# Altium project Elektor_WifiRadio.PrjPcb
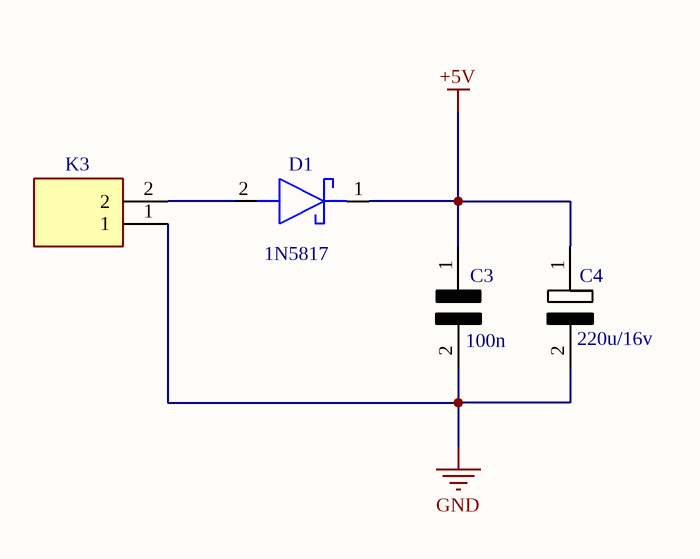
[diagram p0: PowerUnit.SchDoc]
4 sheets, 32 parts. Net scope: flat (ports and power ports of the same name join across sheets).
Sheets:
  PowerUnit.SchDoc
  IR-interface.SchDoc
  ComputeUnit.SchDoc
  DisplayUnit.SchDoc

## Sheet PowerUnit.SchDoc
size A4; SheetNumber: 1; SheetTotal: 4

### Parts
C3  100n  [C0805]
C4  220u/16v  [C0805]
D1  1N5817  [1n5817_footprint]
K3  Con2Polig  [OSTTE020104]  (value not drawn)

### Nets
+5V: C3.1 C4.1 D1.1(K)
GND: C3.2 C4.2 K3.1
NetD1_2: D1.2(A) K3.2

### Library data of the parts
C3 = KeramischeC0805_1: 0805 ceramic capacitor; Manufacturer_Name: Murata Electronics; Manufacturer_Part_Number: GRM188R71H103KA01D; Datasheet Link: https://datasheet.datasheetarchive.com/originals/distributors/Datasheets_SAMA/ec4f1577dddcc7a13ddad897a28002d3.pdf; Height: 0.9mm; Mouser Part Number: 81-GRM39X103K50D; Mouser Price/Stock: https://www.mouser.co.uk/ProductDetail/Murata-Electronics/GRM188R71H103KA01D?qs=WWniysbtxULrL2ljbViAbw%3D%3D; Arrow Part Number: GRM188R71H103KA01D; Arrow Price/Stock: https://www.arrow.com/en/products/grm188r71h103ka01d/murata-manufacturing?region=europe
C4 = elektrolytischeC0805: 0805 ceramic capacitor; Manufacturer_Name: Murata Electronics; Manufacturer_Part_Number: GRM188R71H103KA01D; Datasheet Link: https://datasheet.datasheetarchive.com/originals/distributors/Datasheets_SAMA/ec4f1577dddcc7a13ddad897a28002d3.pdf; Height: 0.9mm; Mouser Part Number: 81-GRM39X103K50D; Mouser Price/Stock: https://www.mouser.co.uk/ProductDetail/Murata-Electronics/GRM188R71H103KA01D?qs=WWniysbtxULrL2ljbViAbw%3D%3D; Arrow Part Number: GRM188R71H103KA01D; Arrow Price/Stock: https://www.arrow.com/en/products/grm188r71h103ka01d/murata-manufacturing?region=europe
D1 = 1N5817: Schottky Diode; Manufacturer_Name: Rectron; Datasheet Link: https://www.arrow.com/en/products/1n5817/rectron; Manufacturer_Part_Number: 1N5817; Arrow Part Number: 1N5817; Arrow Price/Stock: https://www.arrow.com/en/products/1n5817/rectron?region=nac
K3 = Con2Polig: Connector; Manufacturer_Name: On Shore Technology Inc.; Datasheet Link: https://datasheet.datasheetarchive.com/originals/dk/DKDS-18/336634.pdf; Height: 8.7mm; Manufacturer_Part_Number: OSTTE020104

## Sheet IR-interface.SchDoc
size A4; SheetNumber: 2; SheetTotal: 3
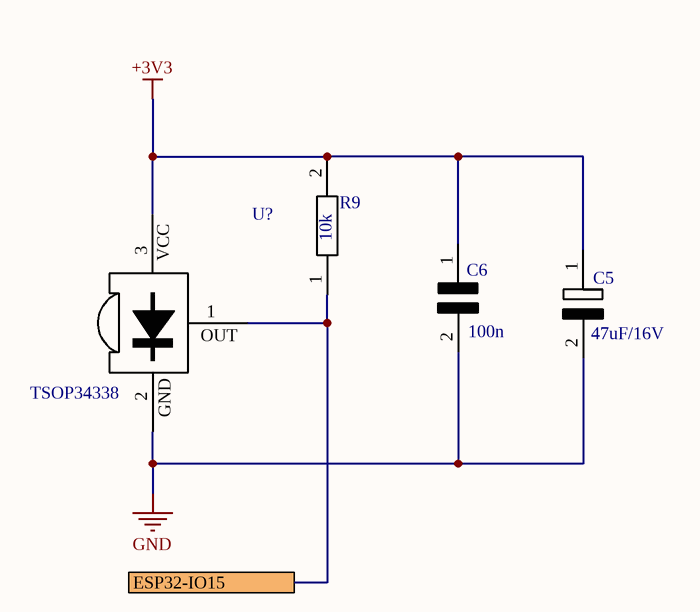
[diagram p1: IR-interface.SchDoc]

### Parts
C5  47uF/16V  [C0805]
C6  100n  [C0805]
R9  10k  [RESC2012X60N]
U?  TSOP34338  [TO_TSOP31236]

### Ports
ESP32-IO15

### Nets
+3V3: C5.1 C6.1 R9.2 U?.3(VS)
GND: C5.2 C6.2 U?.2(GND)
NetJ?_J3_14: R9.1 U?.1(OUT) ; port ESP32-IO15

### Notes on the sheet
- (in symbol TSOP34338) VCC

### Library data of the parts
C5 = elektrolytischeC0805: as C4 on sheet PowerUnit; Datasheet Link: https://datasheet.datasheetarchive.com/originals/distributors/Datasheets_SAMA/ec4f1577dddcc7a13ddad897a28002d3.pdf; Height: 0.9mm; Mouser Part Number: 81-GRM39X103K50D; Mouser Price/Stock: https://www.mouser.co.uk/ProductDetail/Murata-Electronics/GRM188R71H103KA01D?qs=WWniysbtxULrL2ljbViAbw%3D%3D; Arrow Part Number: GRM188R71H103KA01D; Arrow Price/Stock: https://www.arrow.com/en/products/grm188r71h103ka01d/murata-manufacturing?region=europe
C6 = KeramischeC0805_1: as C3 on sheet PowerUnit; Datasheet Link: https://datasheet.datasheetarchive.com/originals/distributors/Datasheets_SAMA/ec4f1577dddcc7a13ddad897a28002d3.pdf; Height: 0.9mm; Mouser Part Number: 81-GRM39X103K50D; Mouser Price/Stock: https://www.mouser.co.uk/ProductDetail/Murata-Electronics/GRM188R71H103KA01D?qs=WWniysbtxULrL2ljbViAbw%3D%3D; Arrow Part Number: GRM188R71H103KA01D; Arrow Price/Stock: https://www.arrow.com/en/products/grm188r71h103ka01d/murata-manufacturing?region=europe
R9 = Resistor0805: Manufacturer_Name: Vishay; Manufacturer_Part_Number: CRCW08050000Z0EAHP; Datasheet Link: https://componentsearchengine.com/Datasheets/1/CRCW08051R00FKEAHP.pdf; Height: 0.6mm; Mouser Part Number: 71-CRCW08050000Z0EAH; Mouser Price/Stock: https://www.mouser.co.uk/ProductDetail/Vishay-Dale/CRCW08050000Z0EAHP?qs=pTGEtN%252BMLlDLrJUqQmN2jA%3D%3D; Arrow Part Number: CRCW08050000Z0EAHP; Arrow Price/Stock: https://www.arrow.com/en/products/crcw08050000z0eahp/vishay?region=nac
U? = TSOP34338: No Description Available; Mfr_Name: Vishay; Type: Type; RefDes: RefDes

## Sheet ComputeUnit.SchDoc
size A4; SheetNumber: 3; SheetTotal: 4
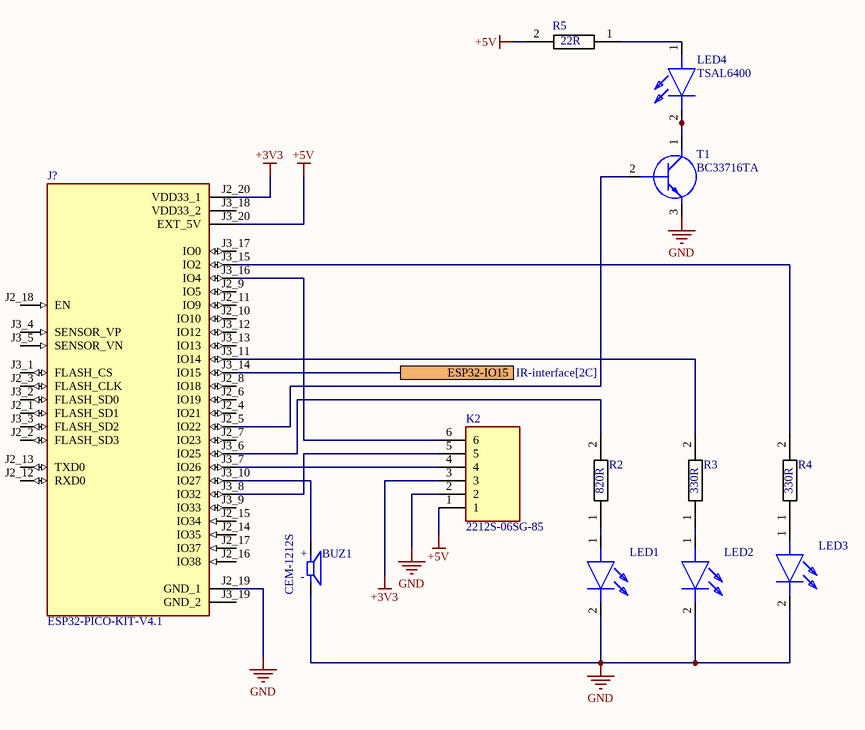
[diagram p2: ComputeUnit.SchDoc]

### Parts
BUZ1  CEM-1212S  [CUI_CEM-1212S]
J?  ESP32-PICO-KIT-V4.1  [XCVR_ESP32-PICO-KIT-V4.1]
K2  2212S-06SG-85  [RHDR6W74P0X254_1X6_1574X250X850P]
LED1  TLHO4200  [TLHO4200]  (value not drawn)
LED2  TLHO4200  [TLHO4200]  (value not drawn)
LED3  TLHO4200  [TLHO4200]  (value not drawn)
LED4  TSAL6400  [TSAL6400]
R2  820R  [RESC2012X60N]
R3  330R  [RESC2012X60N]
R4  330R  [RESC2012X60N]
R5  22R  [RESC2012X60N]
T1  BC33716TA  [BC33716TA]

### Ports
ESP32-IO15 (see IR-interface[2C])

### Nets
+3V3: J?.J2_20(VDD33_1) K2.3
+5V: J?.J3_20(EXT_5V) K2.1 R5.2
GND: BUZ1.M J?.J2_19(GND_1) K2.2 LED1.2(K) LED2.2(K) LED3.2(K) T1.3(E)
NetBUZ1_P: BUZ1.P J?.J3_10(IO27)
NetJ?_J2_5: J?.J2_5(IO22) T1.2(B)
NetJ?_J3_6: J?.J3_6(IO25) R2.2
NetJ?_J3_7: J?.J3_7(IO26) K2.4
NetJ?_J3_8: J?.J3_8(IO32) K2.5
NetJ?_J3_11: J?.J3_11(IO14) R3.2
NetJ?_J3_14: J?.J3_14(IO15) ; port ESP32-IO15
NetJ?_J3_15: J?.J3_15(IO2) R4.2
NetJ?_J3_16: J?.J3_16(IO4) K2.6
NetLED1_1: LED1.1(A) R2.1
NetLED2_1: LED2.1(A) R3.1
NetLED3_1: LED3.1(A) R4.1
NetLED4_1: LED4.1(A) R5.1
NetLED4_2: LED4.2(K) T1.1(C)

Not connected (* = marked no-connect by the designer): J? J2_1(FLASH_SD1) J2_2(FLASH_SD3) J2_3(FLASH_CLK) J2_4(IO21) J2_6(IO19) J2_7(IO23) J2_8(IO18) J2_9(IO5) J2_10(IO10) J2_11(IO9) J2_12(RXD0) J2_13(TXD0) J2_14(IO35) J2_15(IO34) J2_16(IO38) J2_17(IO37) J2_18(EN) J3_1(FLASH_CS) J3_2(FLASH_SD0) J3_3(FLASH_SD2) J3_4(SENSOR_VP) J3_5(SENSOR_VN) J3_9(IO33) J3_12(IO12) J3_13(IO13) J3_17(IO0) J3_18(VDD33_2) J3_19(GND_2)

### Notes on the sheet
- (in symbol CEM-1212S) +; -

### Library data of the parts
BUZ1 = CEM-1212S: 12 mm, 12 V, 85 dB, Through Hole, Sealed, Magnetic Audio Transducer Buzzer; MF: CUI Devices; Arrow_Electronics-Purchase-URL: https://snapeda.com/shop?store=Arrow+Electronics&id=601563; Value: *; SnapEDA_Link: https://www.snapeda.com/parts/CEM-1212S/CUI%20Devices/view-part/601563/?ref=snap; CUI_purchase_URL: https://www.cuidevices.com/product/audio/buzzers/audio-transducers/cem-1212s?utm_source=snapeda.com&utm_medium=referral&utm_campaign=snapedaBOM; MP: CEM-1212S; Availability: Good; Mouser-Purchase-URL: https://snapeda.com/shop?store=Mouser&id=601563; Price: None; DigiKey-Purchase-URL: https://snapeda.com/shop?store=DigiKey&id=601563; Package: TO-220 CUI Inc.
J? = ESP32-PICO-KIT-V4.1: WiFi Development Tools (802.11); MF: Espressif Systems; Price: None; Value: *; MP: ESP32-PICO-KIT-V4.1; Package: None; SnapEDA_Link: https://www.snapeda.com/parts/ESP32-PICO-KIT-V4.1/Espressif%20Systems/view-part/3211113/?ref=snap; Check_prices: https://www.snapeda.com/parts/ESP32-PICO-KIT-V4.1/Espressif%20Systems/view-part/3211113/?ref=eda; Availability: Bad
K2 = 2212S-06SG-85: Connector; Manufacturer_Name: Multicomp Pro; Datasheet Link: http://www.farnell.com/datasheets/2290158.pdf?_ga=2.3406896.1671530057.1506933545-2008293027.1497013038; Height: 8.5mm; Manufacturer_Part_Number: 2212S-06SG-85
LED1-LED3 = TLHO4200: LED; Manufacturer_Name: Vishay; Datasheet Link: https://www.mouser.com/datasheet/2/427/tlhg420-1767350.pdf; Height: 6.1mm; Manufacturer_Part_Number: TLHO4200
LED4 = TSAL6400: LED; Manufacturer_Name: Vishay; Datasheet Link: https://componentsearchengine.com/Datasheets/1/TSAL6400.pdf; Height: 9.7mm; Manufacturer_Part_Number: TSAL6400; Mouser Part Number: 782-TSAL6400; Mouser Price/Stock: https://www.mouser.co.uk/ProductDetail/Vishay-Semiconductors/TSAL6400?qs=oSAwVt7aKTHCOCv1ythi7g%3D%3D; Arrow Part Number: TSAL6400; Arrow Price/Stock: https://www.arrow.com/en/products/tsal6400/vishay?region=nac
R2-R5 = Resistor0805: as R9 on sheet IR-interface; Datasheet Link: https://componentsearchengine.com/Datasheets/1/CRCW08051R00FKEAHP.pdf; Height: 0.6mm; Mouser Part Number: 71-CRCW08050000Z0EAH; Mouser Price/Stock: https://www.mouser.co.uk/ProductDetail/Vishay-Dale/CRCW08050000Z0EAHP?qs=pTGEtN%252BMLlDLrJUqQmN2jA%3D%3D; Arrow Part Number: CRCW08050000Z0EAHP; Arrow Price/Stock: https://www.arrow.com/en/products/crcw08050000z0eahp/vishay?region=nac
T1 = BC33716TA: Transistor BJT NPN; Manufacturer_Name: onsemi; Datasheet Link: https://rocelec.widen.net/view/pdf/hcqqbqwrik/ONSM-S-A0003590550-1.pdf?t.download=true&u=5oefqw; Height: 8.77mm; Manufacturer_Part_Number: BC33716TA; Mouser Part Number: 512-BC33716TA; Mouser Price/Stock: https://www.mouser.co.uk/ProductDetail/onsemi-Fairchild/BC33716TA?qs=UMEuL5FsraA5fR076NzQDQ%3D%3D; Arrow Part Number: BC33716TA; Arrow Price/Stock: https://www.arrow.com/en/products/bc33716ta/on-semiconductor?region=nac

## Sheet DisplayUnit.SchDoc
size A4; SheetNumber: 4; SheetTotal: 4
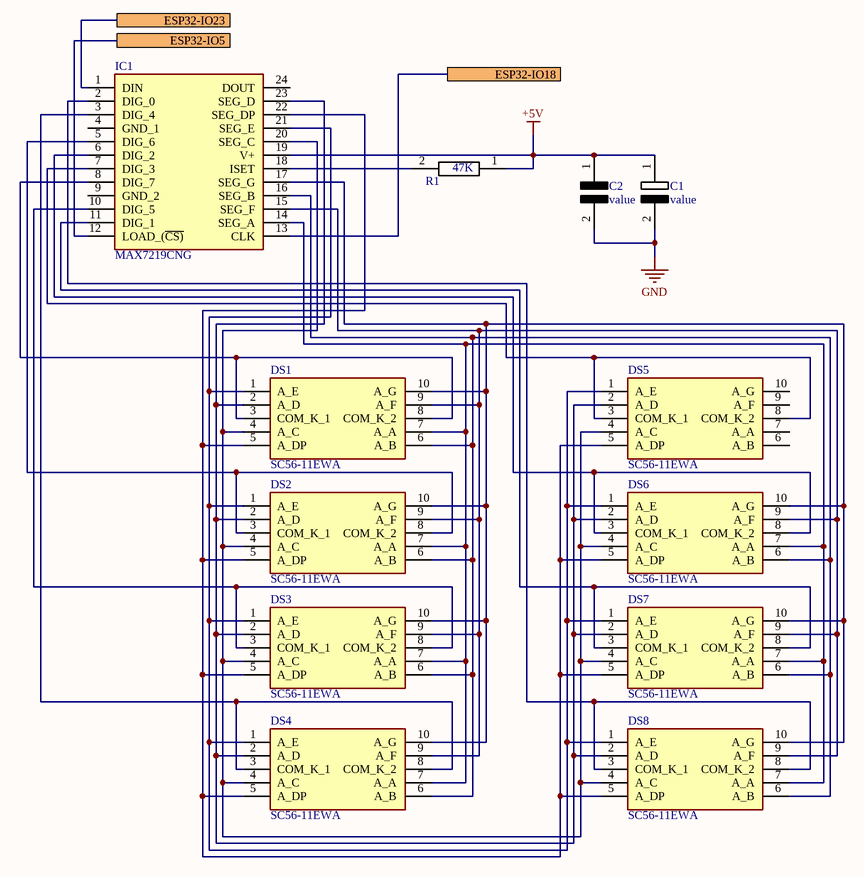
[diagram p3: DisplayUnit.SchDoc]

### Parts
C1  value  [C0805]
C2  value  [C0805]
DS1  SC56-11EWA  [DIPS1524W75P254L1270H825Q10N]
DS2  SC56-11EWA  [DIPS1524W75P254L1270H825Q10N]
DS3  SC56-11EWA  [DIPS1524W75P254L1270H825Q10N]
DS4  SC56-11EWA  [DIPS1524W75P254L1270H825Q10N]
DS5  SC56-11EWA  [DIPS1524W75P254L1270H825Q10N]
DS6  SC56-11EWA  [DIPS1524W75P254L1270H825Q10N]
DS7  SC56-11EWA  [DIPS1524W75P254L1270H825Q10N]
DS8  SC56-11EWA  [DIPS1524W75P254L1270H825Q10N]
IC1  MAX7219CNG  [DIP794W56P254L3054H457Q24N]
R1  47K  [RESC2012X60N]

### Ports
ESP32-IO5, ESP32-IO18, ESP32-IO23

### Nets
+5V: C1.1 C2.1 IC1.19(V+) R1.1
GND: C1.2 C2.2
NetDS1_1: DS1.1(A_E) DS2.1(A_E) DS3.1(A_E) DS4.1(A_E) DS5.1(A_E) DS6.1(A_E) DS7.1(A_E) DS8.1(A_E) IC1.21(SEG_E)
NetDS1_2: DS1.2(A_D) DS2.2(A_D) DS3.2(A_D) DS4.2(A_D) DS5.2(A_D) DS6.2(A_D) DS7.2(A_D) DS8.2(A_D) IC1.23(SEG_D)
NetDS1_3: DS1.3(COM_K_1) DS1.8(COM_K_2) IC1.8(DIG_7)
NetDS1_4: DS1.4(A_C) DS2.4(A_C) DS3.4(A_C) DS4.4(A_C) DS5.4(A_C) DS6.4(A_C) DS7.4(A_C) DS8.4(A_C) IC1.20(SEG_C)
NetDS1_5: DS1.5(A_DP) DS2.5(A_DP) DS3.5(A_DP) DS4.5(A_DP) DS5.5(A_DP) DS6.5(A_DP) DS7.5(A_DP) DS8.5(A_DP) IC1.22(SEG_DP)
NetDS1_6: DS1.6(A_B) DS2.6(A_B) DS3.6(A_B) DS4.6(A_B) DS6.6(A_B) DS7.6(A_B) DS8.6(A_B) IC1.16(SEG_B)
NetDS1_7: DS1.7(A_A) DS2.7(A_A) DS3.7(A_A) DS4.7(A_A) DS6.7(A_A) DS7.7(A_A) DS8.7(A_A) IC1.14(SEG_A)
NetDS1_9: DS1.9(A_F) DS2.9(A_F) DS3.9(A_F) DS4.9(A_F) DS6.9(A_F) DS7.9(A_F) DS8.9(A_F) IC1.15(SEG_F)
NetDS1_10: DS1.10(A_G) DS2.10(A_G) DS3.10(A_G) DS4.10(A_G) DS6.10(A_G) DS7.10(A_G) DS8.10(A_G) IC1.17(SEG_G)
NetDS2_3: DS2.3(COM_K_1) DS2.8(COM_K_2) IC1.5(DIG_6)
NetDS3_3: DS3.3(COM_K_1) DS3.8(COM_K_2) IC1.10(DIG_5)
NetDS4_3: DS4.3(COM_K_1) DS4.8(COM_K_2) IC1.3(DIG_4)
NetDS5_3: DS5.3(COM_K_1) DS5.8(COM_K_2) IC1.7(DIG_3)
NetDS6_3: DS6.3(COM_K_1) DS6.8(COM_K_2) IC1.6(DIG_2)
NetDS7_3: DS7.3(COM_K_1) DS7.8(COM_K_2) IC1.11(DIG_1)
NetDS8_3: DS8.3(COM_K_1) DS8.8(COM_K_2) IC1.2(DIG_0)
NetIC1_1: IC1.1(DIN) ; port ESP32-IO23
NetIC1_12: IC1.12(LOAD_(~{CS)}) ; port ESP32-IO5
NetIC1_13: IC1.13(CLK) ; port ESP32-IO18
NetIC1_18: IC1.18(ISET) R1.2

Not connected (* = marked no-connect by the designer): DS5 6(A_B) 7(A_A) 9(A_F) 10(A_G); IC1 4(GND_1) 9(GND_2) 24(DOUT)

### Library data of the parts
C1 = elektrolytischeC0805: as C4 on sheet PowerUnit; Datasheet Link: https://datasheet.datasheetarchive.com/originals/distributors/Datasheets_SAMA/ec4f1577dddcc7a13ddad897a28002d3.pdf; Height: 0.9mm; Mouser Part Number: 81-GRM39X103K50D; Mouser Price/Stock: https://www.mouser.co.uk/ProductDetail/Murata-Electronics/GRM188R71H103KA01D?qs=WWniysbtxULrL2ljbViAbw%3D%3D; Arrow Part Number: GRM188R71H103KA01D; Arrow Price/Stock: https://www.arrow.com/en/products/grm188r71h103ka01d/murata-manufacturing?region=europe
C2 = KeramischeC0805_1: as C3 on sheet PowerUnit; Datasheet Link: https://datasheet.datasheetarchive.com/originals/distributors/Datasheets_SAMA/ec4f1577dddcc7a13ddad897a28002d3.pdf; Height: 0.9mm; Mouser Part Number: 81-GRM39X103K50D; Mouser Price/Stock: https://www.mouser.co.uk/ProductDetail/Murata-Electronics/GRM188R71H103KA01D?qs=WWniysbtxULrL2ljbViAbw%3D%3D; Arrow Part Number: GRM188R71H103KA01D; Arrow Price/Stock: https://www.arrow.com/en/products/grm188r71h103ka01d/murata-manufacturing?region=europe
DS1-DS8 = SC56-11EWA: Display; Manufacturer_Name: Kingbright; Datasheet Link: https://www.kingbrightusa.com/images/catalog/SPEC/SC56-11EWA.pdf; Height: 8.25mm; Manufacturer_Part_Number: SC56-11EWA; Mouser Part Number: 604-SC56-11EWA; Mouser Price/Stock: https://www.mouser.co.uk/ProductDetail/Kingbright/SC56-11EWA?qs=y3UkhjaxUTZA9319us7IBQ%3D%3D
IC1 = MAX7219CNG: Integrated Circuit; Manufacturer_Name: Analog Devices; Datasheet Link: https://datasheets.maximintegrated.com/en/ds/MAX7219-MAX7221.pdf; Height: 4.572mm; Manufacturer_Part_Number: MAX7219CNG; Mouser Part Number: 700-MAX7219CNG-NR; Mouser Price/Stock: https://www.mouser.co.uk/ProductDetail/Maxim-Integrated/MAX7219CNG?qs=p6VZ%252BklCkRToQRlZGegBBA%3D%3D
R1 = Resistor0805: as R9 on sheet IR-interface; Datasheet Link: https://componentsearchengine.com/Datasheets/1/CRCW08051R00FKEAHP.pdf; Height: 0.6mm; Mouser Part Number: 71-CRCW08050000Z0EAH; Mouser Price/Stock: https://www.mouser.co.uk/ProductDetail/Vishay-Dale/CRCW08050000Z0EAHP?qs=pTGEtN%252BMLlDLrJUqQmN2jA%3D%3D; Arrow Part Number: CRCW08050000Z0EAHP; Arrow Price/Stock: https://www.arrow.com/en/products/crcw08050000z0eahp/vishay?region=nac

## Nets that join several sheets
+3V3: IR-interface (C5.1 C6.1 R9.2 U?.3), ComputeUnit (J?.J2_20 K2.3)
+5V: PowerUnit (C3.1 C4.1 D1.1), ComputeUnit (J?.J3_20 K2.1 R5.2), DisplayUnit (C1.1 C2.1 IC1.19 R1.1)
GND: PowerUnit (C3.2 C4.2 K3.1), IR-interface (C5.2 C6.2 U?.2), ComputeUnit (7 pins), DisplayUnit (C1.2 C2.2)
NetJ?_J3_14: IR-interface (R9.1 U?.1), ComputeUnit (J?.J3_14)